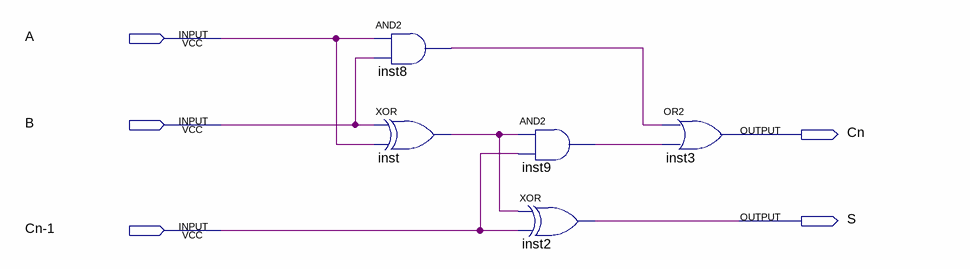
[diagram p0: schematic sheet]
// Quartus schematic whole.bdf as structural Verilog: 5 symbols, 5 pins
module whole (
  input  A,
  input  B,
  input  \Cn-1 ,
  output Cn,
  output S
);

  wire inst8_out, inst9_out, inst_out;

  and inst8 (inst8_out, A, B);
  xor inst (inst_out, B, A);
  and inst9 (inst9_out, inst_out, \Cn-1 );
  xor inst2 (S, inst_out, \Cn-1 );
  or inst3 (Cn, inst8_out, inst9_out);
endmodule
